# Altium project loz-old-man.PrjPcb (part 4 of 5)

## Sheet Microprocessor1.SchDoc
size B; Organization: The Pennsylvania State University - Applied Research Laboratory; DocumentNumber: 9; SheetNumber: 9; SheetTotal: 14; PageSetup: Record=PageOptions|CenterHorizontal=True|CenterVertical=True|PrintScale=0.99|XCorrection=1.00|YCorrection=1.00|PrintKind=1|BorderSize=5000000|LeftOffset=0|BottomOffset=0|Orientation=2|PaperLength=1000|PaperWidth=1000|Scale=100|PaperSource=7|PrintQuality=-4|MediaType=1|DitherType=10|PaperKind=Tabloid (11 x 17")|PrintScaleMode=1; SCHEMATIC_SHEET_TITLE: LPC4357 P0-PA; PAGE_TITLE: -
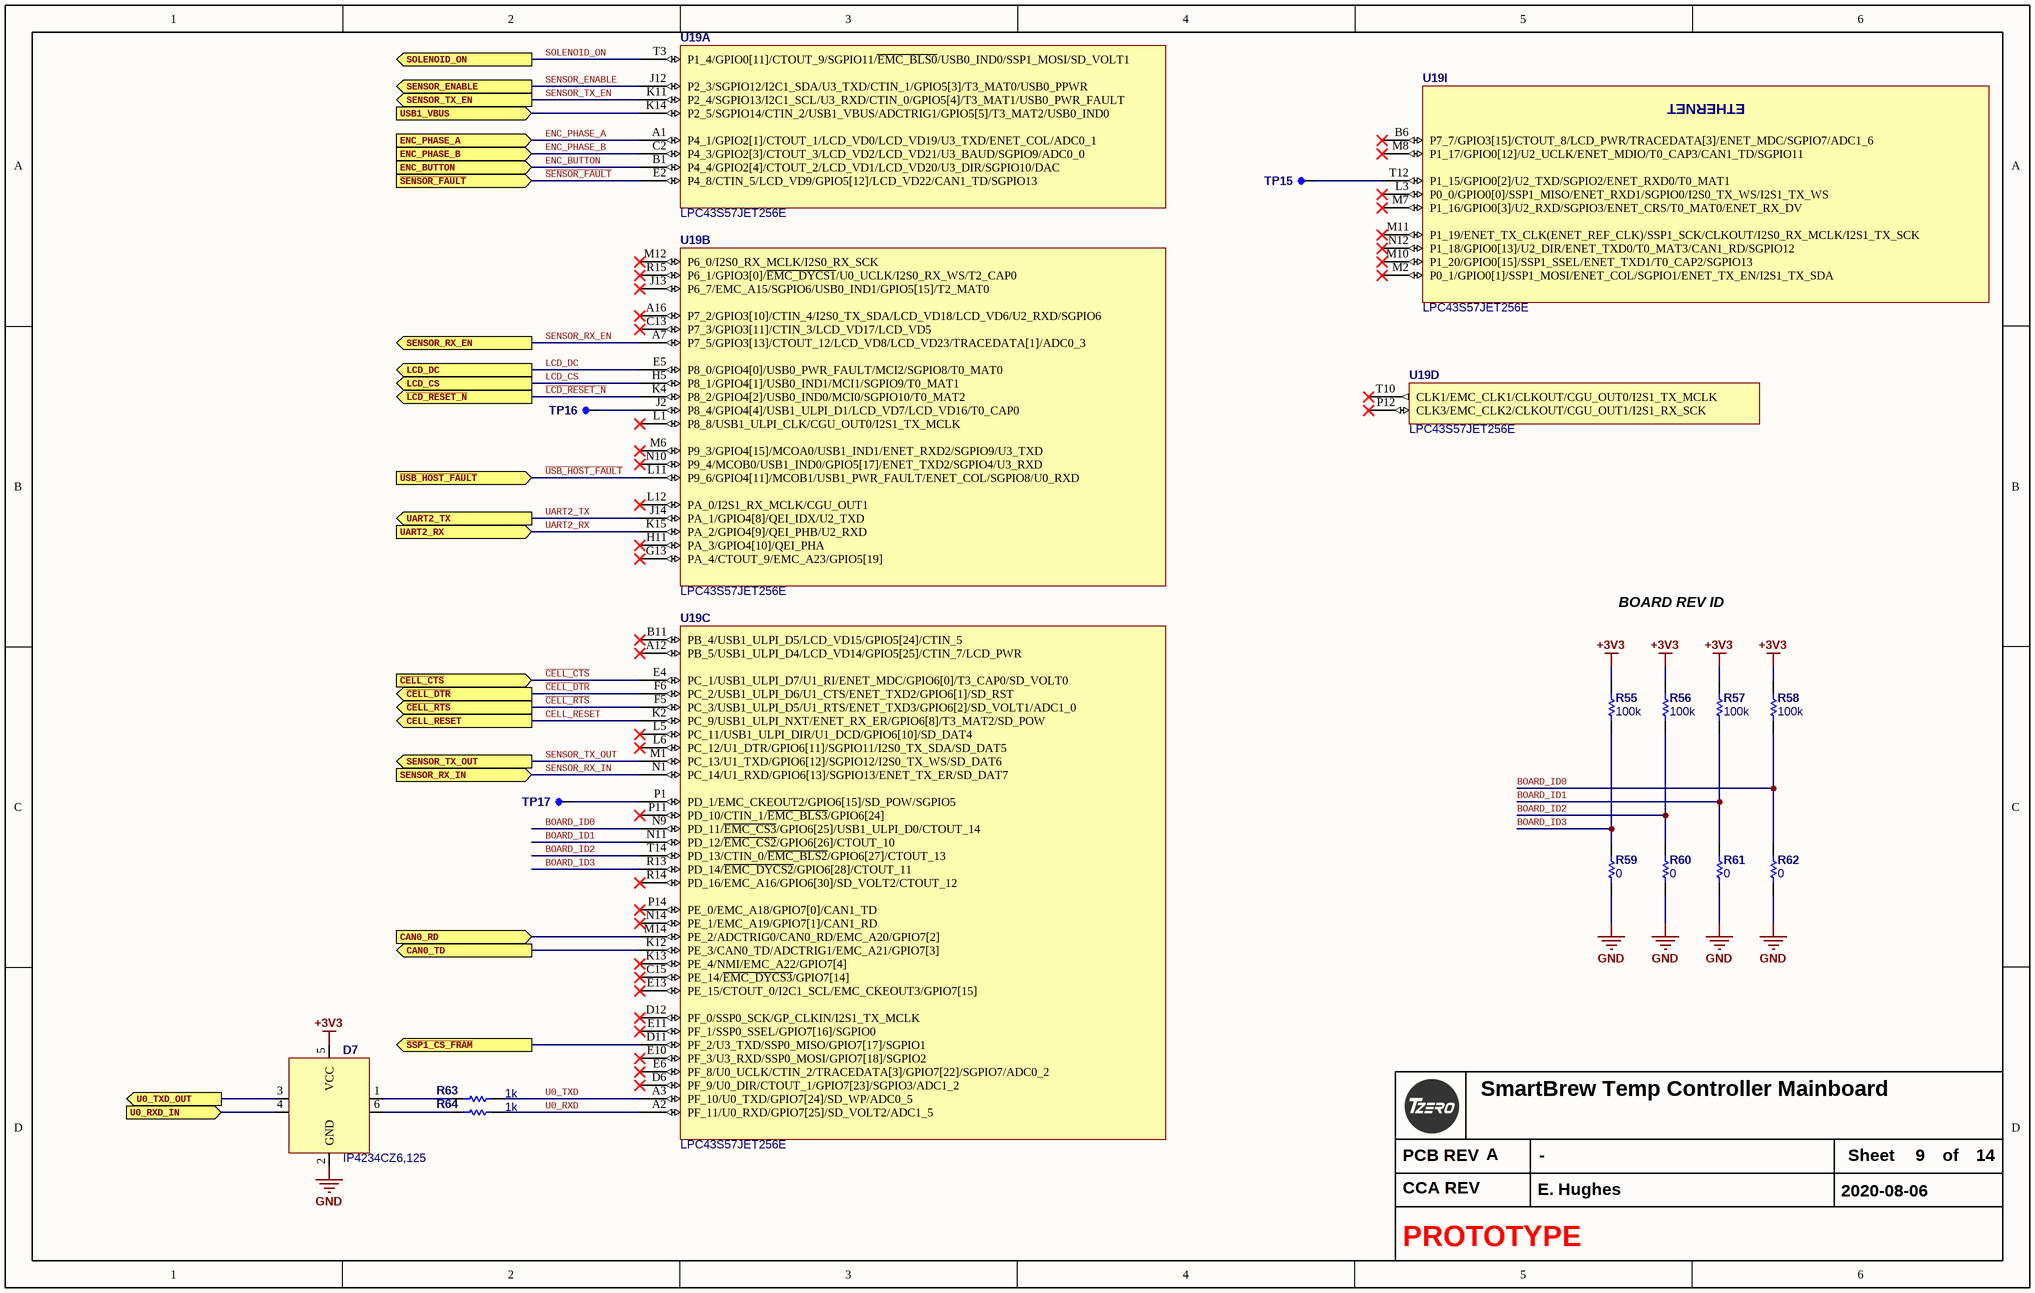
[diagram p9: Microprocessor1.SchDoc]

### Parts
D7  IP4234CZ6,125  [SOT427_MEDIUM]
R55  100k  [R0603_0.55MM_MD]
R56  100k  [R0603_0.55MM_MD]
R57  100k  [R0603_0.55MM_MD]
R58  100k  [R0603_0.55MM_MD]
R59  0  [R0603_0.55MM_MD]
R60  0  [R0603_0.55MM_MD]
R61  0  [R0603_0.55MM_MD]
R62  0  [R0603_0.55MM_MD]
R63  1k  [R0603_0.55MM_MD]
R64  1k  [R0603_0.55MM_MD]
TP15  (no value)  [TP_SMT_25_MIL_ROUND]  (net tie, no BOM)
TP16  (no value)  [TP_SMT_25_MIL_ROUND]  (net tie, no BOM)
TP17  (no value)  [TP_SMT_25_MIL_ROUND]  (net tie, no BOM)
U19  LPC43S57JET256E  [LBGA256 16X16 1700X1700X155]  (parts A,B,C,D,I of 10)

### Ports
CAN0_RD (in), CAN0_TD (out), CELL_RESET (out), ENC_BUTTON (in), ENC_PHASE_A (in), ENC_PHASE_B (in), LCD_CS (out), LCD_DC (out), SENSOR_ENABLE (out), SENSOR_RX_EN (out), SENSOR_RX_IN (in), SENSOR_TX_EN (out), SENSOR_TX_OUT (out), SOLENOID_ON (out), U0_RXD_IN (in), U0_TXD_OUT (out), UART2_RX (in), UART2_TX (out), USB1_VBUS (in), ~{CELL_CTS} (in), ~{CELL_DTR} (out), ~{CELL_RTS} (out), ~{LCD_RESET_N} (out), ~{SENSOR_FAULT} (in), ~{SSP1_CS_FRAM} (out), ~{USB_HOST_FAULT} (in)

### Nets
+3V3: D7.5(VCC) R55.1 R56.1 R57.1 R58.1
GND: D7.2(GND) R59.2 R60.2 R61.2 R62.2
~{CELL_CTS}: U19.E4(PC_1/USB1_ULPI_D7/U1_RI/ENET_MDC/GPIO6[0]/T3_CAP0/SD_VOLT0) ; port ~{CELL_CTS}
~{CELL_DTR}: U19.F6(PC_2/USB1_ULPI_D6/U1_CTS/ENET_TXD2/GPIO6[1]/SD_RST) ; port ~{CELL_DTR}
~{CELL_RTS}: U19.F5(PC_3/USB1_ULPI_D5/U1_RTS/ENET_TXD3/GPIO6[2]/SD_VOLT1/ADC1_0) ; port ~{CELL_RTS}
~{LCD_RESET_N}: U19.K4(P8_2/GPIO4[2]/USB0_IND0/MCI0/SGPIO10/T0_MAT2) ; port ~{LCD_RESET_N}
~{SENSOR_FAULT}: U19.E2(P4_8/CTIN_5/LCD_VD9/GPIO5[12]/LCD_VD22/CAN1_TD/SGPIO13) ; port ~{SENSOR_FAULT}
~{SSP1_CS_FRAM}: U19.D11(PF_2/U3_TXD/SSP0_MISO/GPIO7[17]/SGPIO1) ; port ~{SSP1_CS_FRAM}
~{USB_HOST_FAULT}: U19.L11(P9_6/GPIO4[11]/MCOB1/USB1_PWR_FAULT/ENET_COL/SGPIO8/U0_RXD) ; port ~{USB_HOST_FAULT}
BOARD_ID0: R58.2 R62.1 U19.N9(PD_11/~{EMC_CS3}/GPIO6[25]/USB1_ULPI_D0/CTOUT_14)
BOARD_ID1: R57.2 R61.1 U19.N11(PD_12/~{EMC_CS2}/GPIO6[26]/CTOUT_10)
BOARD_ID2: R56.2 R60.1 U19.T14(PD_13/CTIN_0/~{EMC_BLS2}/GPIO6[27]/CTOUT_13)
BOARD_ID3: R55.2 R59.1 U19.R13(PD_14/~{EMC_DYCS2}/GPIO6[28]/CTOUT_11)
CAN0_RD: U19.M14(PE_2/ADCTRIG0/CAN0_RD/EMC_A20/GPIO7[2]) ; port CAN0_RD
CAN0_TD: U19.K12(PE_3/CAN0_TD/ADCTRIG1/EMC_A21/GPIO7[3]) ; port CAN0_TD
CELL_RESET: U19.K2(PC_9/USB1_ULPI_NXT/ENET_RX_ER/GPIO6[8]/T3_MAT2/SD_POW) ; port CELL_RESET
ENC_BUTTON: U19.B1(P4_4/GPIO2[4]/CTOUT_2/LCD_VD1/LCD_VD20/U3_DIR/SGPIO10/DAC) ; port ENC_BUTTON
ENC_PHASE_A: U19.A1(P4_1/GPIO2[1]/CTOUT_1/LCD_VD0/LCD_VD19/U3_TXD/ENET_COL/ADC0_1) ; port ENC_PHASE_A
ENC_PHASE_B: U19.C2(P4_3/GPIO2[3]/CTOUT_3/LCD_VD2/LCD_VD21/U3_BAUD/SGPIO9/ADC0_0) ; port ENC_PHASE_B
LCD_CS: U19.H5(P8_1/GPIO4[1]/USB0_IND1/MCI1/SGPIO9/T0_MAT1) ; port LCD_CS
LCD_DC: U19.E5(P8_0/GPIO4[0]/USB0_PWR_FAULT/MCI2/SGPIO8/T0_MAT0) ; port LCD_DC
SENSOR_ENABLE: U19.J12(P2_3/SGPIO12/I2C1_SDA/U3_TXD/CTIN_1/GPIO5[3]/T3_MAT0/USB0_PPWR) ; port SENSOR_ENABLE
SENSOR_RX_EN: U19.A7(P7_5/GPIO3[13]/CTOUT_12/LCD_VD8/LCD_VD23/TRACEDATA[1]/ADC0_3) ; port SENSOR_RX_EN
SENSOR_RX_IN: U19.N1(PC_14/U1_RXD/GPIO6[13]/SGPIO13/ENET_TX_ER/SD_DAT7) ; port SENSOR_RX_IN
SENSOR_TX_EN: U19.K11(P2_4/SGPIO13/I2C1_SCL/U3_RXD/CTIN_0/GPIO5[4]/T3_MAT1/USB0_PWR_FAULT) ; port SENSOR_TX_EN
SENSOR_TX_OUT: U19.M1(PC_13/U1_TXD/GPIO6[12]/SGPIO12/I2S0_TX_WS/SD_DAT6) ; port SENSOR_TX_OUT
SOLENOID_ON: U19.T3(P1_4/GPIO0[11]/CTOUT_9/SGPIO11/~{EMC_BLS0}/USB0_IND0/SSP1_MOSI/SD_VOLT1) ; port SOLENOID_ON
U0_RXD: R64.2 U19.A2(PF_11/U0_RXD/GPIO7[25]/SD_VOLT2/ADC1_5)
U0_RXD_IN: D7.4 ; port U0_RXD_IN
U0_TXD: R63.2 U19.A3(PF_10/U0_TXD/GPIO7[24]/SD_WP/ADC0_5)
U0_TXD_OUT: D7.3 ; port U0_TXD_OUT
UART2_RX: U19.K15(PA_2/GPIO4[9]/QEI_PHB/U2_RXD) ; port UART2_RX
UART2_TX: U19.J14(PA_1/GPIO4[8]/QEI_IDX/U2_TXD) ; port UART2_TX
USB1_VBUS: U19.K14(P2_5/SGPIO14/CTIN_2/USB1_VBUS/ADCTRIG1/GPIO5[5]/T3_MAT2/USB0_IND0) ; port USB1_VBUS
NetD7_1: D7.1 R63.1
NetD7_6: D7.6 R64.1
NetTP15_1: TP15.1 U19.T12(P1_15/GPIO0[2]/U2_TXD/SGPIO2/ENET_RXD0/T0_MAT1)
NetTP16_1: TP16.1 U19.J2(P8_4/GPIO4[4]/USB1_ULPI_D1/LCD_VD7/LCD_VD16/T0_CAP0)
NetTP17_1: TP17.1 U19.P1(PD_1/EMC_CKEOUT2/GPIO6[15]/SD_POW/SGPIO5)

Not connected (* = marked no-connect by the designer): U19 A12(PB_5/USB1_ULPI_D4/LCD_VD14/GPIO5[25]/CTIN_7/LCD_PWR)* A16(P7_2/GPIO3[10]/CTIN_4/I2S0_TX_SDA/LCD_VD18/LCD_VD6/U2_RXD/SGPIO6)* B6(P7_7/GPIO3[15]/CTOUT_8/LCD_PWR/TRACEDATA[3]/ENET_MDC/SGPIO7/ADC1_6)* B11(PB_4/USB1_ULPI_D5/LCD_VD15/GPIO5[24]/CTIN_5)* C13(P7_3/GPIO3[11]/CTIN_3/LCD_VD17/LCD_VD5)* C15(PE_14/~{EMC_DYCS3}/GPIO7[14])* D6(PF_9/U0_DIR/CTOUT_1/GPIO7[23]/SGPIO3/ADC1_2)* D12(PF_0/SSP0_SCK/GP_CLKIN/I2S1_TX_MCLK)* E6(PF_8/U0_UCLK/CTIN_2/TRACEDATA[3]/GPIO7[22]/SGPIO7/ADC0_2)* E10(PF_3/U3_RXD/SSP0_MOSI/GPIO7[18]/SGPIO2)* E11(PF_1/SSP0_SSEL/GPIO7[16]/SGPIO0)* E13(PE_15/CTOUT_0/I2C1_SCL/EMC_CKEOUT3/GPIO7[15])* G13(PA_4/CTOUT_9/EMC_A23/GPIO5[19])* H11(PA_3/GPIO4[10]/QEI_PHA)* J13(P6_7/EMC_A15/SGPIO6/USB0_IND1/GPIO5[15]/T2_MAT0)* K13(PE_4/NMI/EMC_A22/GPIO7[4])* L1(P8_8/USB1_ULPI_CLK/CGU_OUT0/I2S1_TX_MCLK)* L3(P0_0/GPIO0[0]/SSP1_MISO/ENET_RXD1/SGPIO0/I2S0_TX_WS/I2S1_TX_WS)* L5(PC_11/USB1_ULPI_DIR/U1_DCD/GPIO6[10]/SD_DAT4)* L6(PC_12/U1_DTR/GPIO6[11]/SGPIO11/I2S0_TX_SDA/SD_DAT5)* L12(PA_0/I2S1_RX_MCLK/CGU_OUT1)* M2(P0_1/GPIO0[1]/SSP1_MOSI/ENET_COL/SGPIO1/ENET_TX_EN/I2S1_TX_SDA)* M6(P9_3/GPIO4[15]/MCOA0/USB1_IND1/ENET_RXD2/SGPIO9/U3_TXD)* M7(P1_16/GPIO0[3]/U2_RXD/SGPIO3/ENET_CRS/T0_MAT0/ENET_RX_DV)* M8(P1_17/GPIO0[12]/U2_UCLK/ENET_MDIO/T0_CAP3/CAN1_TD/SGPIO11)* M10(P1_20/GPIO0[15]/SSP1_SSEL/ENET_TXD1/T0_CAP2/SGPIO13)* M11(P1_19/ENET_TX_CLK(ENET_REF_CLK)/SSP1_SCK/CLKOUT/I2S0_RX_MCLK/I2S1_TX_SCK)* M12(P6_0/I2S0_RX_MCLK/I2S0_RX_SCK)* N10(P9_4/MCOB0/USB1_IND0/GPIO5[17]/ENET_TXD2/SGPIO4/U3_RXD)* N12(P1_18/GPIO0[13]/U2_DIR/ENET_TXD0/T0_MAT3/CAN1_RD/SGPIO12)* N14(PE_1/EMC_A19/GPIO7[1]/CAN1_RD)* P11(PD_10/CTIN_1/~{EMC_BLS3}/GPIO6[24])* P12(CLK3/EMC_CLK2/CLKOUT/CGU_OUT1/I2S1_RX_SCK)* P14(PE_0/EMC_A18/GPIO7[0]/CAN1_TD)* R14(PD_16/EMC_A16/GPIO6[30]/SD_VOLT2/CTOUT_12)* R15(P6_1/GPIO3[0]/~{EMC_DYCS1}/U0_UCLK/I2S0_RX_WS/T2_CAP0)* T10(CLK1/EMC_CLK1/CLKOUT/CGU_OUT0/I2S1_TX_MCLK)*

### Notes on the sheet
- BOARD REV ID
- PCB REV
- Sheet
- of
- CCA REV
- (in symbol LPC43S57JET256E, part I) ETHERNET

### Library data of the parts
D7 = IP4234CZ6,125: IC USB2.0 ESD PROTECTION SOT457; Manufacturer: NXP Semiconductors; CategorySort: 400; Voltage - Reverse Standoff (Typ): 3V; Voltage - Breakdown: 6V; Power (Watts): 100W; Polarization: 2 Channel Array - Bidirectional; Value: IP4234CZ6,125; Sort Value: *; Category: Diodes; Supplier 1: Digi-Key; Supplier Part Number 1: 568-5869-1-ND; Manufacturer Part Number: IP4234CZ6,125; RoHS: RoHS Compliant; Stock 1: 5142; Pricing 1: 1=0.52, 10=0.418, 25=0.3656, 100=0.3135, 250=0.27076, 500=0.23276, 1000=0.1805 (USD); Mounting Type: Surface Mount; Package: SC-74, SOT-457; Supplier Device Package: 6-TSOP; Packaging: Cut Tape (CT); ComponentLink1URL: http://www.nxp.com/documents/data_sheet/IP4234CZ6.pdf; ComponentLink1Description: http://www.nxp.com/documents/data_sheet/IP4234CZ6.pdf; Manufacturer 1: NXP Semiconductors; Manufacturer Part Number 1: IP4234CZ6,125
R55-R58 = ERJ-3EKF1003V: RES 100K OHM 1/10W 1% 0603 SMD; Manufacturer: Panasonic Electronic Components; Package Power: 0603  (0.1W); Power (Watts): 0.1W- 1/10W; Temperature Coefficient: ±100ppm/°C; Limiting Element Voltage: 75; Maximum Overload Voltage: 150; Maximum Working Voltage: 75.0V; Substitution Notes: 100k , ±1% , 0603 , AEC-Q200; Value: 100k; Manufacturer Part Number: ERJ-3EKF1003V; ComponentLink1Description: Internal Datasheet; ComponentLink1URL: datasheets\Panasonic Electronic Components\AOA0000CE2.pdf; ComponentLink2Description: External Datasheet; ComponentLink2URL: http://industrial.panasonic.com/www-data/pdf/AOA0000/AOA0000CE2.pdf; Supplier 1: Digi-Key; Supplier Part Number 1: P100KHCT-ND; Category: Resistors; Resistance (Ohms): 100k; Composition: Thick Film; Features: -; Tolerance: ±1%; Package: 0603 (1608 Metric); Supplier Package: 0603; Size / Dimension: 0.063" L x 0.031" W (1.60mm x 0.80mm); Height: 0.55MM; Number of Terminations: 2; Packaging: Cut Tape (CT); Sort Value: 100000; Sort Value Package: 603_100000; Ratings: AEC-Q200
R59-R62 = ERJ-3GEY0R00V: RES 0.0 OHM 1/10W JUMP 0603 SMD; Manufacturer: Panasonic Electronic Components; Power (Watts): 0.1W- 1/10W; Tolerance: Jumper; Package Power: 0603  (0.1W); Limiting Element Voltage: 75; Maximum Overload Voltage: 150; Maximum Working Voltage: 0.0V; Substitution Notes: 0 , Jumper , 0603 , AEC-Q200; Value: 0; Supplier 1: Digi-Key; Supplier Part Number 1: P0.0GCT-ND; Manufacturer Part Number: ERJ-3GEY0R00V; Category: Resistors; Sort Value: 0; Composition: Thick Film; Features: -; Temperature Coefficient: -; Package: 0603 (1608 Metric); Size / Dimension: 0.063" L x 0.031" W (1.60mm x 0.80mm); Height: 0.55MM; ComponentLink1URL: datasheets\Panasonic Electronic Components\AOA0000CE1.pdf; ComponentLink1Description: Internal Datasheet; ComponentLink2Description: External Datasheet; ComponentLink2URL: http://industrial.panasonic.com/www-data/pdf/AOA0000/AOA0000CE1.pdf; Resistance (Ohms): 0; Supplier Package: 0603; Number of Terminations: 2; Sort Value Package: 603_0; Ratings: AEC-Q200
R63 R64 = ERJ-3EKF1001V: RES 1K OHM 1/10W 1% 0603 SMD; Manufacturer: Panasonic Electronic Components; Package Power: 0603  (0.1W); Power (Watts): 0.1W- 1/10W; Temperature Coefficient: ±100ppm/°C; Limiting Element Voltage: 75; Maximum Overload Voltage: 150; Maximum Working Voltage: 10.0V; Substitution Notes: 1k , ±1% , 0603 , AEC-Q200; Value: 1k; Manufacturer Part Number: ERJ-3EKF1001V; ComponentLink1Description: Internal Datasheet; ComponentLink1URL: datasheets\Panasonic Electronic Components\AOA0000CE2.pdf; ComponentLink2Description: External Datasheet; ComponentLink2URL: http://industrial.panasonic.com/www-data/pdf/AOA0000/AOA0000CE2.pdf; Supplier 1: Digi-Key; Supplier Part Number 1: P1.00KHCT-ND; Category: Resistors; Resistance (Ohms): 1k; Composition: Thick Film; Features: -; Tolerance: ±1%; Package: 0603 (1608 Metric); Supplier Package: 0603; Size / Dimension: 0.063" L x 0.031" W (1.60mm x 0.80mm); Height: 0.55MM; Number of Terminations: 2; Packaging: Cut Tape (CT); Sort Value: 1000; Sort Value Package: 603_1000; Ratings: AEC-Q200
TP15-TP17 = TP SMT 25MIL: Sort Value: *; Category: *; CategorySort: *
U19 = LPC43S57JET256E: ARM Microcontrollers - MCU CortexM0/4 32bit 1MB Cortex-M4/M0; Manufacturer: NXP Semiconductors; CategorySort: 600; Data RAM Size: 136 KB; Core: ARM Cortex M4/M0; Maximum Clock Frequency: 204 MHz; On-Chip ADC: Yes; Operating Supply Voltage: 2.2 V to 3.6 V; Processor Series: LPC4357; Product Status: New Technology; Value: LPC43S57JET256E; Sort Value: *; Category: Integrated Circuits; Supplier 1: Digi-Key; Supplier Part Number 1: 568-11712-ND; Manufacturer Part Number: LPC43S57JET256E; RoHS: RoHS Compliant; Stock 1: 108; Pricing 1: 1=14.40, 25=13.31, 100=12.24, 250=11.16, 500=10.43, 1000=9.57 (USD); Package: LBGA-256; Packaging: Tray; Mounting Style: SMD/SMT; Program Memory Size: 1 MB; Data Bus Width: 32 bit; Maximum Operating Temperature: + 85 C; Minimum Operating Temperature: - 40 C; Standard Pack Qty: 90; Tradename: LPC; RoHS - Mouser: Y; Minimum Order Quantity: 1; Reeling: False; ComponentLink1URL: http://www.nxp.com/documents/data_sheet/LPC4357_53_37_33.pdf; ComponentLink1Description: http://www.nxp.com/documents/data_sheet/LPC4357_53_37_33.pdf

## Sheet Microprocessor Power.SchDoc
size B; Organization: The Pennsylvania State University - Applied Research Laboratory; DocumentNumber: 8; SheetNumber: 8; SheetTotal: 14; PageSetup: Record=PageOptions|CenterHorizontal=True|CenterVertical=True|PrintScale=0.99|XCorrection=1.00|YCorrection=1.00|PrintKind=1|BorderSize=5000000|LeftOffset=0|BottomOffset=0|Orientation=2|PaperLength=1000|PaperWidth=1000|Scale=100|PaperSource=7|PrintQuality=-4|MediaType=1|DitherType=10|PaperKind=Tabloid (11 x 17")|PrintScaleMode=1; SCHEMATIC_SHEET_TITLE: MICROPROCESSOR POWER; PAGE_TITLE: -
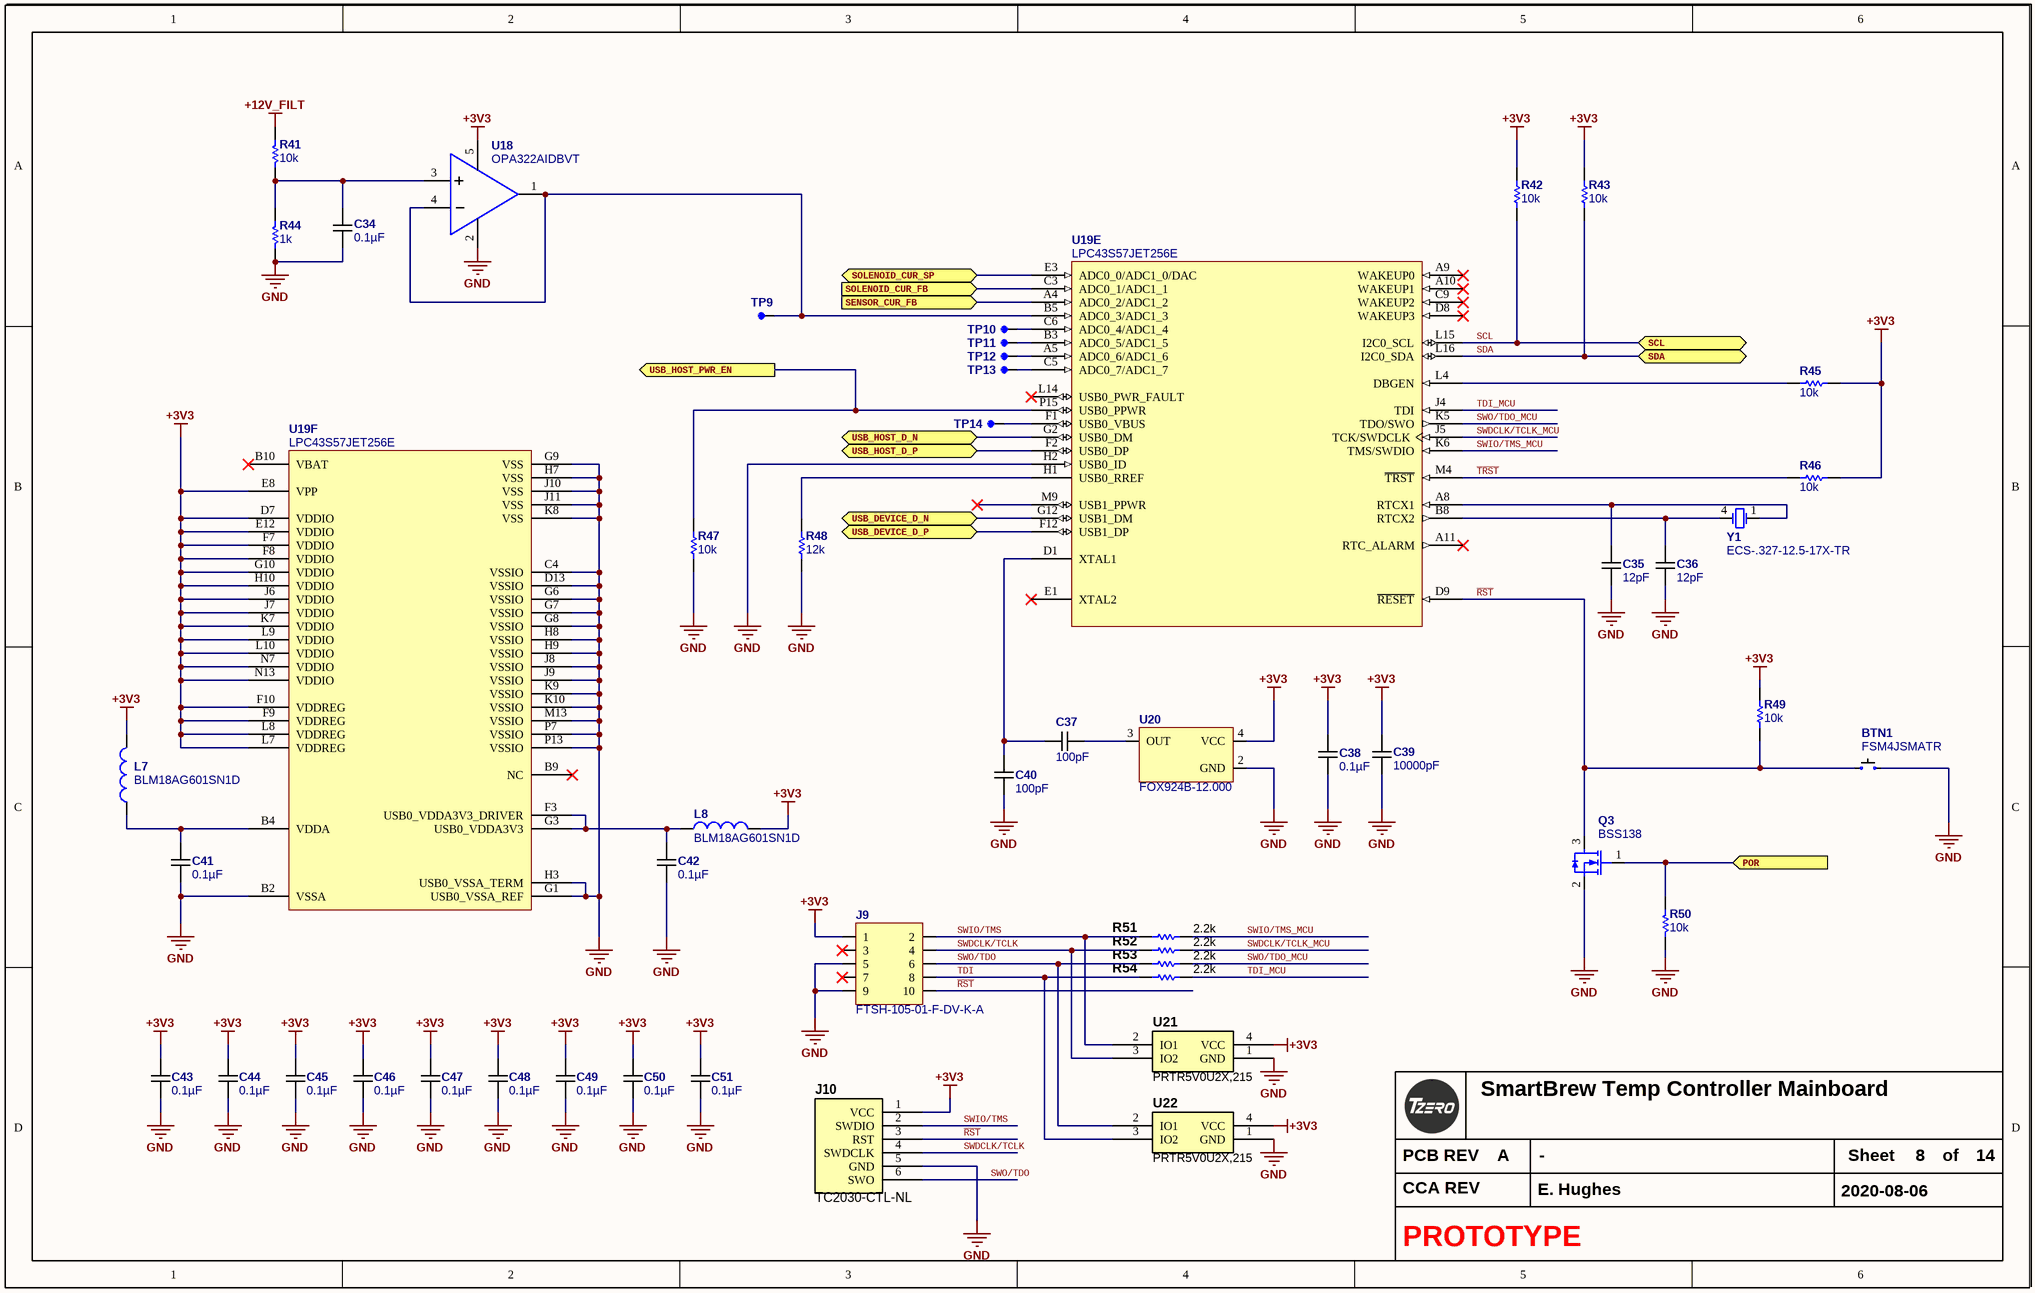
[diagram p10: Microprocessor Power.SchDoc]

### Parts
BTN1  FSM4JSMATR  [FSM4JSMA]
C34  0.1µF  [C0402_0.55MM_HD]
C35  12pF  [C0603_0.90MM_HD]
C36  12pF  [C0603_0.90MM_HD]
C37  100pF  [C0603_0.95MM_HD]
C38  0.1µF  [C0402_0.55MM_HD]
C39  10000pF  [C0603_0.90MM_HD]
C40  100pF  [C0603_0.95MM_HD]
C41  0.1µF  [C0402_0.55MM_HD]
C42  0.1µF  [C0402_0.55MM_HD]
C43  0.1µF  [C0402_0.55MM_HD]
C44  0.1µF  [C0402_0.55MM_HD]
C45  0.1µF  [C0402_0.55MM_HD]
C46  0.1µF  [C0402_0.55MM_HD]
C47  0.1µF  [C0402_0.55MM_HD]
C48  0.1µF  [C0402_0.55MM_HD]
C49  0.1µF  [C0402_0.55MM_HD]
C50  0.1µF  [C0402_0.55MM_HD]
C51  0.1µF  [C0402_0.55MM_HD]
J9  FTSH-105-01-F-DV-K-A  [FTSH-105-01-F-DV-K-A]
J10  TC2030‐CTL‐NL  [TC2030]  (no BOM)
L7  BLM18AG601SN1D  [L_0603_0.8mm]
L8  BLM18AG601SN1D  [L_0603_0.8mm]
Q3  BSS138  [SOT23_Medium]
R41  10k  [R0603_0.55MM_MD]
R42  10k  [R0603_0.55MM_HD]
R43  10k  [R0603_0.55MM_HD]
R44  1k  [R0603_0.55MM_MD]
R45  10k  [R0603_0.55MM_HD]
R46  10k  [R0603_0.55MM_HD]
R47  10k  [R0603_0.55MM_MD]
R48  12k  [R0603_0.55MM_HD]
R49  10k  [R0603_0.55MM_HD]
R50  10k  [R0603_0.55MM_HD]
R51  2.2k  [R0603_0.55MM_MD]
R52  2.2k  [R0603_0.55MM_MD]
R53  2.2k  [R0603_0.55MM_MD]
R54  2.2k  [R0603_0.55MM_MD]
TP9  (no value)  [TP_SMT_25_MIL_ROUND]  (net tie, no BOM)
TP10  (no value)  [TP_SMT_25_MIL_ROUND]  (net tie, no BOM)
TP11  (no value)  [TP_SMT_25_MIL_ROUND]  (net tie, no BOM)
TP12  (no value)  [TP_SMT_25_MIL_ROUND]  (net tie, no BOM)
TP13  (no value)  [TP_SMT_25_MIL_ROUND]  (net tie, no BOM)
TP14  (no value)  [TP_SMT_25_MIL_ROUND]  (net tie, no BOM)
U18  OPA322AIDBVT  [SOT23-5]
U19  LPC43S57JET256E  [LBGA256 16X16 1700X1700X155]  (parts E,F of 10)
U20  FOX924B-12.000  [FOX924]
U21  PRTR5V0U2X,215  [SOT143B]
U22  PRTR5V0U2X,215  [SOT143B]
Y1  ECS-.327-12.5-17X-TR  [ECX-306]

### Ports
POR (in), SCL (bidir), SDA (bidir), SENSOR_CUR_FB (in), SOLENOID_CUR_FB (in), SOLENOID_CUR_SP (bidir), USB_DEVICE_D_N (bidir), USB_DEVICE_D_P (bidir), USB_HOST_D_N (bidir), USB_HOST_D_P (bidir), USB_HOST_PWR_EN (out)

### Nets
+3V3: C38.2 C39.2 C43.2 C44.2 C45.2 C46.2 C47.2 C48.2 C49.2 C50.2 C51.2 J9.1 J10.1(VCC) L7.2 L8.2 R42.1 R43.1 R45.2 R46.2 R49.2 U18.5(VCC) U19.D7(VDDIO) U19.E8(VPP) U19.E12(VDDIO) U19.F7(VDDIO) U19.F8(VDDIO) U19.F9(VDDREG) U19.F10(VDDREG) U19.G10(VDDIO) U19.H10(VDDIO) U19.J6(VDDIO) U19.J7(VDDIO) U19.K7(VDDIO) U19.L7(VDDREG) U19.L8(VDDREG) U19.L9(VDDIO) U19.L10(VDDIO) U19.N7(VDDIO) U19.N13(VDDIO) U20.4(VCC) U21.4(VCC) U22.4(VCC)
+12V_FILT: R41.2
GND: BTN1.B C34.1 C35.1 C36.1 C38.1 C39.1 C40.2 C41.1 C42.1 C43.1 C44.1 C45.1 C46.1 C47.1 C48.1 C49.1 C50.1 C51.1 J9.5 J9.9 J10.5(GND) Q3.2(S) R44.2 R47.2 R48.2 R50.1 U18.2(GND) U19.B2(VSSA) U19.C4(VSSIO) U19.D13(VSSIO) U19.G1(USB0_VSSA_REF) U19.G6(VSSIO) U19.G7(VSSIO) U19.G8(VSSIO) U19.G9(VSS) U19.H2(USB0_ID) U19.H3(USB0_VSSA_TERM) U19.H7(VSS) U19.H8(VSSIO) U19.H9(VSSIO) U19.J8(VSSIO) U19.J9(VSSIO) U19.J10(VSS) U19.J11(VSS) U19.K8(VSS) U19.K9(VSSIO) U19.K10(VSSIO) U19.M13(VSSIO) U19.P7(VSSIO) U19.P13(VSSIO) U20.2(GND) U21.1(GND) U22.1(GND)
~{RST}: BTN1.A J9.10 J10.3(RST) Q3.3(D) R49.1 U19.D9(~{RESET})
~{TRST}: R46.1 U19.M4(~{TRST})
POR: Q3.1(G) R50.2 ; port POR
SCL: R42.2 U19.L15(I2C0_SCL) ; port SCL
SDA: R43.2 U19.L16(I2C0_SDA) ; port SDA
SENSOR_CUR_FB: U19.A4(ADC0_2/ADC1_2) ; port SENSOR_CUR_FB
SOLENOID_CUR_FB: U19.C3(ADC0_1/ADC1_1) ; port SOLENOID_CUR_FB
SOLENOID_CUR_SP: U19.E3(ADC0_0/ADC1_0/DAC) ; port SOLENOID_CUR_SP
SWDCLK/TCLK: J9.4 J10.4(SWDCLK) R52.1 U21.3(IO2)
SWDCLK/TCLK_MCU: R52.2 U19.J5(TCK/SWDCLK)
SWIO/TMS: J9.2 J10.2(SWDIO) R51.1 U21.2(IO1)
SWIO/TMS_MCU: R51.2 U19.K6(TMS/SWDIO)
SWO/TDO: J9.6 J10.6(SWO) R53.1 U22.2(IO1)
SWO/TDO_MCU: R53.2 U19.K5(TDO/SWO)
TDI: J9.8 R54.1 U22.3(IO2)
TDI_MCU: R54.2 U19.J4(TDI)
USB_DEVICE_D_N: U19.G12(USB1_DM) ; port USB_DEVICE_D_N
USB_DEVICE_D_P: U19.F12(USB1_DP) ; port USB_DEVICE_D_P
USB_HOST_D_N: U19.G2(USB0_DM) ; port USB_HOST_D_N
USB_HOST_D_P: U19.F2(USB0_DP) ; port USB_HOST_D_P
USB_HOST_PWR_EN: R47.1 U19.P15(USB0_PPWR) ; port USB_HOST_PWR_EN
NetC34_2: C34.2 R41.1 R44.1 U18.3(+)
NetC35_2: C35.2 U19.A8(RTCX1) Y1.1(OSC1)
NetC36_2: C36.2 U19.B8(RTCX2) Y1.4(OSC2)
NetC37_1: C37.1 U20.3(OUT)
NetC37_2: C37.2 C40.1 U19.D1(XTAL1)
NetC41_2: C41.2 L7.1 U19.B4(VDDA)
NetC42_2: C42.2 L8.1 U19.F3(USB0_VDDA3V3_DRIVER) U19.G3(USB0_VDDA3V3)
NetR45_1: R45.1 U19.L4(DBGEN)
NetR48_1: R48.1 U19.H1(USB0_RREF)
NetTP9_1: TP9.1 U18.1(OUT) U18.4(-) U19.B5(ADC0_3/ADC1_3)
NetTP10_1: TP10.1 U19.C6(ADC0_4/ADC1_4)
NetTP11_1: TP11.1 U19.B3(ADC0_5/ADC1_5)
NetTP12_1: TP12.1 U19.A5(ADC0_6/ADC1_6)
NetTP13_1: TP13.1 U19.C5(ADC0_7/ADC1_7)
NetTP14_1: TP14.1 U19.F1(USB0_VBUS)

Not connected (* = marked no-connect by the designer): J9 3* 7*; U19 A9(WAKEUP0)* A10(WAKEUP1)* A11(RTC_ALARM)* B9(NC)* B10(VBAT)* C9(WAKEUP2)* D8(WAKEUP3)* E1(XTAL2)* L14(USB0_PWR_FAULT)* M9(USB1_PPWR)*

### Notes on the sheet
- PCB REV
- Sheet
- of
- CCA REV

### Library data of the parts
BTN1 = FSM4JSMATR: SWITCH TACTILE SPST-NO 0.05A 12V; Manufacturer: TE Connectivity; Switch Function: Off-Mom; Contact Rating @ Voltage: 0.05A @ 12VDC; Actuator Type: Standard; Actuator Orientation: Top Actuated; Outline: 6.00mm x 6.00mm; Illumination: Non-Illuminated; Operating Force: 160gf; Supplier 1: Digi-Key; Supplier Part Number 1: 450-1759-1-ND; Manufacturer Part Number: FSM4JSMATR; RoHS: RoHS Compliant; Category: Switches; Stock 1: 35617; Pricing 1: 1=0.36, 10=0.34, 25=0.2912, 50=0.2474, 100=0.2377, 250=0.21344, 500=0.20374 (USD); Circuit: SPST-NO; Mounting Type: Surface Mount; Termination Style: Gull Wing; Packaging: Cut Tape (CT); ComponentLink1URL: http://documents.tycoelectronics.com/commerce/DocumentDelivery/DDEController?Action=srchrtrv&DocNm=2-1437565-7&DocType=CD&DocLang=EN; ComponentLink1Description: http://documents.tycoelectronics.com/commerce/DocumentDelivery/DDEController?Action=srchrtrv&DocNm=2-1437565-7&DocType=CD&DocLang=EN; Value: FSM4JSMATR
C34 C38 C41-C51 = CGA2B3X7R1E104K050BB: CAP CER 0.1UF 25V X7R 0402; Manufacturer: TDK Corporation; Tolerance: ±10%; Substitution Notes: 0.1µF , 25V , ±10% , X7R , -55°C ~ 125°C , AEC-Q200 , 0402; Value: 0.1µF; Temperature Coefficient: X7R; Manufacturer Part Number: CGA2B3X7R1E104K050BB; ComponentLink1Description: Datasheet (Internal); ComponentLink1URL: datasheets\TDK\mlcc_automotive_general_en.pdf; ComponentLink2Description: Datasheet (External); ComponentLink2URL: https://product.tdk.com/info/en/catalog/datasheets/mlcc_automotive_general_en.pdf; Supplier 1: Digikey; Supplier Part Number 1: 445-6902-1-ND; Category: Capacitors; Voltage - Rated: 25V; Features: -; Operating Temperature: -55°C ~ 125°C; Ratings: AEC-Q200; Package: 0402; Thickness (Max): 0.55MM
C35 C36 = CGA3E2C0G1H120J080AA: CAP CER 12PF 50V C0G 0603; Manufacturer: TDK Corporation; Temperature Coefficient: C0G, NP0; Tolerance: ±5%; Substitution Notes: 12pF , 50V , ±5% , C0G, NP0 , -55°C ~ 125°C , AEC-Q200 , 0603; Value: 12pF; Manufacturer Part Number: CGA3E2C0G1H120J080AA; ComponentLink1Description: Datasheet (Internal); ComponentLink1URL: datasheets\TDK\mlcc_automotive_general_en.pdf; ComponentLink2Description: Datasheet (External); ComponentLink2URL: https://product.tdk.com/info/en/catalog/datasheets/mlcc_automotive_general_en.pdf; Supplier 1: Digikey; Supplier Part Number 1: 445-5629-1-ND; Category: Capacitors; Voltage - Rated: 50V; Operating Temperature: -55°C ~ 125°C; Ratings: AEC-Q200; Package: 0603; Thickness (Max): 0.90MM; Features: -
C37 C40 = CGA3E2C0G1H101J080AE: CAP CER 100PF 50V NP0 0603; Manufacturer: TDK Corporation; Temperature Coefficient: C0G, NP0; Tolerance: ±5%; Substitution Notes: 100pF , 50V , ±5% , C0G, NP0 , -55°C ~ 125°C , AEC-Q200 , 0603; Value: 100pF; Manufacturer Part Number: CGA3E2C0G1H101J080AE; ComponentLink1Description: Datasheet (Internal); ComponentLink1URL: datasheets\TDK\mlcc_automotive_general_en.pdf; ComponentLink2Description: Datasheet (External); ComponentLink2URL: https://product.tdk.com/info/en/catalog/datasheets/mlcc_automotive_general_en.pdf; Supplier 1: Digikey; Supplier Part Number 1: 445-173653-1-ND; Category: Capacitors; Voltage - Rated: 50V; Operating Temperature: -55°C ~ 125°C; Ratings: AEC-Q200; Package: 0603; Thickness (Max): 0.95MM; Features: Soft Termination
C39 = CGA3E2C0G1H103J080AA: CAP CER 10000PF 50V C0G 0603; Manufacturer: TDK Corporation; Temperature Coefficient: C0G, NP0; Tolerance: ±5%; Substitution Notes: 10000pF , 50V , ±5% , C0G, NP0 , -55°C ~ 125°C , AEC-Q200 , 0603; Value: 10000pF; Manufacturer Part Number: CGA3E2C0G1H103J080AA; ComponentLink1Description: Datasheet (Internal); ComponentLink1URL: datasheets\TDK\mlcc_automotive_general_en.pdf; ComponentLink2Description: Datasheet (External); ComponentLink2URL: https://product.tdk.com/info/en/catalog/datasheets/mlcc_automotive_general_en.pdf; Supplier 1: Digikey; Supplier Part Number 1: 445-6916-1-ND; Category: Capacitors; Voltage - Rated: 50V; Features: -; Operating Temperature: -55°C ~ 125°C; Ratings: AEC-Q200; Package: 0603; Thickness (Max): 0.90MM
J9 = FTSH-105-01-F-DV-K-A: CONN HEADER 10POS DUAL .05" SMD; Manufacturer: Samtec Inc; CategorySort: 800; Connector Type: Header, Unshrouded; Number of Positions: 10; Number of Positions Loaded: All; Pitch: 0.050" (1.27mm); Value: FTSH-105-01-F-DV-K-A; Sort Value: *; Category: Connectors; Supplier 1: Digi-Key; Supplier Part Number 1: FTSH-105-01-F-DV-K-A-ND; Manufacturer Part Number: FTSH-105-01-F-DV-K-A; RoHS: RoHS Compliant; Stock 1: 0; Pricing 1: 1=3.59 (USD); Packaging: Tube; Contact Type: Male Pin; Number of Rows: 2; Row Spacing: 0.050" (1.27mm); Contact Mating Length: 0.120" (3.05mm); Mounting Type: Surface Mount; Termination: Solder; Fastening Type: -; Features: -; Contact Finish: Gold; Contact Finish Thickness: 3µin (0.08µm); Color: Black; ComponentLink1URL: http://www.samtec.com/documents/webfiles/cpdf/FTSH-1XX-XX-XXX-DV-XXX-MKT.pdf; ComponentLink1Description: http://www.samtec.com/documents/webfiles/cpdf/FTSH-1XX-XX-XXX-DV-XXX-MKT.pdf
J10 = TC2030‐CTL‐NL: Tag Connect Pads - No latching Clips - ARM; Value: TC2030‐CTL‐NL
L7 L8 = BLM18AG601SN1D: FERRITE CHIP 600 OHM 500MA 0603; Manufacturer: Murata Electronics North America; CategorySort: 300; Impedance @ Frequency: 600 Ohm @ 100MHz; DC Resistance (DCR): 380 mOhm Max; Filter Type: Differential Mode - Single; Value: BLM18AG601SN1D; Sort Value: *; Category: Inductors; Supplier 1: Digi-Key; Supplier Part Number 1: 490-1014-1-ND; Manufacturer Part Number: BLM18AG601SN1D; RoHS: RoHS Compliant; Stock 1: 139441; Pricing 1: 1=0.1, 10=0.079, 50=0.0648, 100=0.0476, 250=0.0346, 500=0.0317, 1000=0.02738 (USD); Current Rating: 500mA; Package: 0603 (1608 Metric); Mounting Type: Surface Mount; Packaging: Cut Tape (CT); Height (Max): 0.037" (0.95mm); Size / Dimension: 0.063" L x 0.031" W (1.60mm x 0.80mm); ComponentLink1URL: http://search.murata.co.jp/Ceramy/image/img/PDF/ENG/L0110S0100BLM18A.pdf; ComponentLink1Description: http://search.murata.co.jp/Ceramy/image/img/PDF/ENG/L0110S0100BLM18A.pdf
Q3 = BSS138: FAIRCHILD SEMICONDUCTOR - BSS138 - N CHANNEL MOSFET, 50V, 220mA SOT-23; CategorySort: 500; Value: BSS138; Sort Value: *; Category: Semiconductors; Supplier 1: Newark; Manufacturer: FAIRCHILD SEMICONDUCTOR; Manufacturer Part Number: BSS138; RoHS: YES; Stock 1: 17000; Pricing 1: 1=0.077, 25=0.064, 100=0.049, 250=0.039, 500=0.035, 1000=0.03 (USD); ComponentLink1URL: http://www.fairchildsemi.com/ds/BS/BSS138.pdf; ComponentLink1Description: http://www.fairchildsemi.com/ds/BS/BSS138.pdf; Supplier Part Number 1: 58K8769; Package: SOT-23
R41 R50 = ERJ-3EKF1002V: RES 10K OHM 1/10W 1% 0603 SMD; Manufacturer: Panasonic Electronic Components; Package Power: 0603  (0.1W); Power (Watts): 0.1W- 1/10W; Temperature Coefficient: ±100ppm/°C; Limiting Element Voltage: 75; Maximum Overload Voltage: 150; Maximum Working Voltage: 31.6V; Substitution Notes: 10k , ±1% , 0603 , AEC-Q200; Value: 10k; Manufacturer Part Number: ERJ-3EKF1002V; ComponentLink1Description: Internal Datasheet; ComponentLink1URL: datasheets\Panasonic Electronic Components\AOA0000CE2.pdf; ComponentLink2Description: External Datasheet; ComponentLink2URL: http://industrial.panasonic.com/www-data/pdf/AOA0000/AOA0000CE2.pdf; Supplier 1: Digi-Key; Supplier Part Number 1: P10.0KHCT-ND; Category: Resistors; Resistance (Ohms): 10k; Composition: Thick Film; Features: -; Tolerance: ±1%; Package: 0603 (1608 Metric); Supplier Package: 0603; Size / Dimension: 0.063" L x 0.031" W (1.60mm x 0.80mm); Height: 0.55MM; Number of Terminations: 2; Packaging: Cut Tape (CT); Sort Value: 10000; Sort Value Package: 603_10000; Ratings: AEC-Q200
R42 R43 R45-R47 R49 = ERJ-3EKF1002V: RES 10K OHM 1/10W 1% 0603 SMD; Manufacturer: Panasonic Electronic Components; Power (Watts): 0.1W- 1/10W; Temperature Coefficient: ±100ppm/°C; Package Power: 0603  (0.1W); Limiting Element Voltage: 75; Maximum Overload Voltage: 150; Maximum Working Voltage: 31.6V; Substitution Notes: 10k , ±1% , 0603 , AEC-Q200; Value: 10k; Supplier 1: Digi-Key; Supplier Part Number 1: P10.0KHCT-ND; Manufacturer Part Number: ERJ-3EKF1002V; Category: Resistors; Sort Value: 10000; Composition: Thick Film; Features: -; Tolerance: ±1%; Package: 0603 (1608 Metric); Size / Dimension: 0.063" L x 0.031" W (1.60mm x 0.80mm); Height: 0.55MM; Packaging: Cut Tape (CT); ComponentLink1URL: datasheets\Panasonic Electronic Components\AOA0000CE2.pdf; ComponentLink1Description: Internal Datasheet; ComponentLink2Description: External Datasheet; ComponentLink2URL: http://industrial.panasonic.com/www-data/pdf/AOA0000/AOA0000CE2.pdf; Resistance (Ohms): 10k; Supplier Package: 0603; Number of Terminations: 2; Sort Value Package: 603_10000; Ratings: AEC-Q200
R44 = ERJ-3EKF1001V: as R63 on sheet Microprocessor1; Value: 1k; Manufacturer Part Number: ERJ-3EKF1001V; ComponentLink1Description: Internal Datasheet; ComponentLink1URL: datasheets\Panasonic Electronic Components\AOA0000CE2.pdf; ComponentLink2Description: External Datasheet; ComponentLink2URL: http://industrial.panasonic.com/www-data/pdf/AOA0000/AOA0000CE2.pdf; Supplier 1: Digi-Key; Supplier Part Number 1: P1.00KHCT-ND; Category: Resistors; Resistance (Ohms): 1k; Composition: Thick Film; Features: -; Tolerance: ±1%; Package: 0603 (1608 Metric); Supplier Package: 0603; Size / Dimension: 0.063" L x 0.031" W (1.60mm x 0.80mm); Height: 0.55MM; Number of Terminations: 2; Packaging: Cut Tape (CT); Sort Value: 1000; Sort Value Package: 603_1000; Ratings: AEC-Q200
R48 = ERJ-3EKF1202V: RES 12K OHM 1/10W 1% 0603 SMD; Manufacturer: Panasonic Electronic Components; Power (Watts): 0.1W- 1/10W; Temperature Coefficient: ±100ppm/°C; Package Power: 0603  (0.1W); Limiting Element Voltage: 75; Maximum Overload Voltage: 150; Maximum Working Voltage: 34.6V; Substitution Notes: 12k , ±1% , 0603 , AEC-Q200; Value: 12k; Supplier 1: Digi-Key; Supplier Part Number 1: P12.0KHCT-ND; Manufacturer Part Number: ERJ-3EKF1202V; Category: Resistors; Sort Value: 12000; Composition: Thick Film; Features: -; Tolerance: ±1%; Package: 0603 (1608 Metric); Size / Dimension: 0.063" L x 0.031" W (1.60mm x 0.80mm); Height: 0.55MM; Packaging: Cut Tape (CT); ComponentLink1URL: datasheets\Panasonic Electronic Components\AOA0000CE2.pdf; ComponentLink1Description: Internal Datasheet; ComponentLink2Description: External Datasheet; ComponentLink2URL: http://industrial.panasonic.com/www-data/pdf/AOA0000/AOA0000CE2.pdf; Resistance (Ohms): 12k; Supplier Package: 0603; Number of Terminations: 2; Sort Value Package: 603_12000; Ratings: AEC-Q200
R51-R54 = ERJ-3EKF2201V: RES 2.2K OHM 1/10W 1% 0603 SMD; Manufacturer: Panasonic Electronic Components; Package Power: 0603  (0.1W); Power (Watts): 0.1W- 1/10W; Temperature Coefficient: ±100ppm/°C; Limiting Element Voltage: 75; Maximum Overload Voltage: 150; Maximum Working Voltage: 14.8V; Substitution Notes: 2.2k , ±1% , 0603 , AEC-Q200; Value: 2.2k; Manufacturer Part Number: ERJ-3EKF2201V; ComponentLink1Description: Internal Datasheet; ComponentLink1URL: datasheets\Panasonic Electronic Components\AOA0000CE2.pdf; ComponentLink2Description: External Datasheet; ComponentLink2URL: http://industrial.panasonic.com/www-data/pdf/AOA0000/AOA0000CE2.pdf; Supplier 1: Digi-Key; Supplier Part Number 1: P2.20KHCT-ND; Category: Resistors; Resistance (Ohms): 2.2k; Composition: Thick Film; Features: -; Tolerance: ±1%; Package: 0603 (1608 Metric); Supplier Package: 0603; Size / Dimension: 0.063" L x 0.031" W (1.60mm x 0.80mm); Height: 0.55MM; Number of Terminations: 2; Packaging: Cut Tape (CT); Sort Value: 2200; Sort Value Package: 603_2200; Ratings: AEC-Q200
TP9-TP14 = TP SMT 25MIL: Sort Value: *; Category: *; CategorySort: *
U18 = OPA322AIDBVT: IC OPAMP GP 20MHZ RRO SOT23-5; Manufacturer: Texas Instruments; Number of Channels: 1; Min Supply Voltage: 1.8V; Max Supply Voltage: 5.5V; Slew Rate: 10V/µs; Input Bias Current: 10pA; Input Offset Voltage (Vos): 2mV; Voltage Gain: 130dB; Common Mode Rejection Ratio: 90dB; Operating Supply Current: 1.6mA; Nominal Supply Current: 1.5mA; Output Current per Channel: 65mA; Min Dual Supply Voltage: 900mV; Max Dual Supply Voltage: 2.75V; Power Supply Rejection Ratio (PSRR): 100dB; Max Frequency: 10MHz; Manufacturer Part Number: OPA322AIDBVT; Value: OPA322AIDBVT; Supplier 1: Digi-Key; Supplier Part Number 1: 296-29511-1-ND; RoHS: Yes; Category: Amplifiers - Op Amps, Buffer, Instrumentation; Stock: 3683; Pricing: 1=1.66000, 10=1.49500, 25=1.41000, 100=1.12800 (USD); Case/Package: SOT-23; Number of Pins: 5; Min Operating Temperature: -40°C; Max Operating Temperature: 125°C; Packaging: Tape and Reel; Package Quantity: 250; Number of Circuits: 1; Gain Bandwidth Product: 20MHz; Unity Gain Bandwidth Product: 20MHz; Number of Elements: 1; Max I/O Voltage: 2mV; Nominal Gain Bandwidth Product: 20MHz; Output Current: 65mA; Bandwidth: 20MHz; Number of Amplifiers: 1; Operating Supply Voltage: 2.75V; Length: 3.05mm; Height: 1.3mm; Width: 1.75mm; Radiation Hardening: No; Lead Free: Lead Free; REACH SVHC: No SVHC; ComponentLink1URL: https://datasheet.ciiva.com/1803/opa322-1803459.pdf?src-supplier=Digi-Key; ComponentLink1Description: https://datasheet.ciiva.com/1803/opa322-1803459.pdf?src-supplier=Digi-Key; ComponentLink2URL: https://datasheet.ciiva.com/7848/1481239-7848179.pdf?src-supplier=Element14; ComponentLink2Description: https://datasheet.ciiva.com/7848/1481239-7848179.pdf?src-supplier=Element14; ComponentLink3URL: https://datasheet.ciiva.com/1803/opa322-1803460.pdf?src-supplier=Digi-Key; ComponentLink3Description: https://datasheet.ciiva.com/1803/opa322-1803460.pdf?src-supplier=Digi-Key; ComponentLink4URL: https://datasheet.ciiva.com/1803/opa322-1803461.pdf?src-supplier=Digi-Key; ComponentLink4Description: https://datasheet.ciiva.com/1803/opa322-1803461.pdf?src-supplier=Digi-Key; ComponentLink5URL: https://datasheet.ciiva.com/14460/opa4322-14460092.pdf?src-supplier=Avnet; ComponentLink5Description: https://datasheet.ciiva.com/14460/opa4322-14460092.pdf?src-supplier=Avnet; ComponentLink6URL: https://datasheet.ciiva.com/48706/001071938-da-01-en-ic-opamp-gp-rr-opa322aidbvt-sot-23-5-tid-48706602.pdf?src-supplier=Conrad; ComponentLink6Description: https://datasheet.ciiva.com/48706/001071938-da-01-en-ic-opamp-gp-rr-opa322aidbvt-sot-23-5-tid-48706602.pdf?src-supplier=Conrad
U19 = LPC43S57JET256E: as U19 on sheet Microprocessor1; Value: LPC43S57JET256E; Sort Value: *; Category: Integrated Circuits; Supplier 1: Digi-Key; Supplier Part Number 1: 568-11712-ND; Manufacturer Part Number: LPC43S57JET256E; RoHS: RoHS Compliant; Stock 1: 108; Pricing 1: 1=14.40, 25=13.31, 100=12.24, 250=11.16, 500=10.43, 1000=9.57 (USD); Package: LBGA-256; Packaging: Tray; Mounting Style: SMD/SMT; Program Memory Size: 1 MB; Data Bus Width: 32 bit; Maximum Operating Temperature: + 85 C; Minimum Operating Temperature: - 40 C; Standard Pack Qty: 90; Tradename: LPC; RoHS - Mouser: Y; Minimum Order Quantity: 1; Reeling: False; ComponentLink1URL: http://www.nxp.com/documents/data_sheet/LPC4357_53_37_33.pdf; ComponentLink1Description: http://www.nxp.com/documents/data_sheet/LPC4357_53_37_33.pdf
U20 = FOX924B-12.000: OSC TCXO 12.00MHZ HCMOS SMD; Manufacturer: Fox Electronics; CategorySort: 600; Frequency: 12MHz; Voltage - Supply: 3.3V; Frequency Stability: ±2.5ppm; Current - Supply (Max): 6mA; Value: FOX924B-12.000; Sort Value: *; Category: Integrated Circuits; Supplier 1: Digi-Key; Supplier Part Number 1: 631-1068-1-ND; Manufacturer Part Number: FOX924B-12.000; RoHS: RoHS Compliant; Stock 1: 2663; Pricing 1: 1=3.76, 10=3.591, 50=3.403, 100=3.0438, 500=2.8728 (USD); Type: TCXO; Function: -; Output: HCMOS; Operating Temperature: -30°C ~ 85°C; Ratings: -; Mounting Type: Surface Mount; Size / Dimension: 0.197" L x 0.126" W (5.00mm x 3.20mm); Height: 0.059" (1.50mm); Package: 4-SMD, No Lead (DFN, LCC); Packaging: Cut Tape (CT); Current - Supply (Disable) (Max): -; ComponentLink1URL: http://www.foxonline.com/pdfs/fox924.pdf; ComponentLink1Description: http://www.foxonline.com/pdfs/fox924.pdf
U21 U22 = PRTR5V0U2X,215: TVS DIODE 5.5VWM SOT143B; Manufacturer: NXP Semiconductors; Bidirectional Channels: 2; Voltage - Reverse Standoff (Typ): 5.5V (Max); Voltage - Breakdown (Min): 6V; Power Line Protection: Yes; Capacitance @ Frequency: 1pF @ 1MHz; Supplier 1: Digi-Key; Supplier Part Number 1: 568-4140-1-ND; Manufacturer Part Number: PRTR5V0U2X,215; RoHS: RoHS Compliant; Category: Circuit Protection; Stock: 11734; Pricing: 1=0.57, 10=0.477, 25=0.418, 100=0.3578, 250=0.31036, 500=0.26286, 1000=0.20265 (USD); Packaging: Cut Tape (CT); Type: Steering (Rail to Rail); Unidirectional Channels: -; Voltage - Clamping (Max) @ Ipp: -; Current - Peak Pulse (10/1000µs): -; Power - Peak Pulse: -; Applications: General Purpose; Operating Temperature: -40°C ~ 85°C (TA); Mounting Type: Surface Mount; Package / Case: TO-253-4, TO-253AA; Supplier Device Package: SOT-143B; ComponentLink1URL: http://www.nxp.com/documents/data_sheet/PRTR5V0U2X.pdf; ComponentLink1Description: http://www.nxp.com/documents/data_sheet/PRTR5V0U2X.pdf; Value: PRTR5V0U2X,215
Y1 = ECS-.327-12.5-17X-TR: CRYSTAL 32.768KHZ 12.5PF SMD; Manufacturer: ECS Inc; CategorySort: 600; Frequency Tolerance: ±20ppm; ESR (Equivalent Series Resistance): 50 kOhm; Operating Mode: Fundamental; Value: ECS-.327-12.5-17X-TR; Sort Value: *; Category: Integrated Circuits; Supplier 1: Digi-Key; Supplier Part Number 1: XC1195CT-ND; Manufacturer Part Number: ECS-.327-12.5-17X-TR; RoHS: RoHS Compliant; Stock 1: 17619; Pricing 1: 1=1.31, 10=1.138, 50=0.9976, 100=0.7875, 500=0.665, 1000=0.525 (USD); Packaging: Cut Tape (CT); Type: kHz Crystal (Tuning Fork); Frequency: 32.768kHz; Frequency Stability: -; Load Capacitance: 12.5pF; Operating Temperature: -40°C ~ 85°C; Ratings: -; Mounting Type: Surface Mount; Package: 4-SOJ, 5.50mm pitch; Size / Dimension: 0.315" L x 0.150" W (8.00mm x 3.80mm); Height: 0.098" (2.50mm); ComponentLink1URL: http://www.ecsxtal.com/store/pdf/ecx-306x.pdf; ComponentLink1Description: http://www.ecsxtal.com/store/pdf/ecx-306x.pdf

## Sheet Flash Memory.SchDoc
size B; Organization: Pyrotechnics Management Inc.; DocumentNumber: 11; SheetNumber: 11; SheetTotal: 14; PageSetup: Record=PageOptions|CenterHorizontal=True|CenterVertical=True|PrintScale=0.99|XCorrection=1.00|YCorrection=1.00|PrintKind=1|BorderSize=5000000|LeftOffset=0|BottomOffset=0|Orientation=2|PaperLength=1000|PaperWidth=1000|Scale=100|PaperSource=7|PrintQuality=-4|MediaType=1|DitherType=10|PaperKind=Tabloid (11 x 17")|PrintScaleMode=1; SCHEMATIC_SHEET_TITLE: FLASH MEMORY; PAGE_TITLE: -
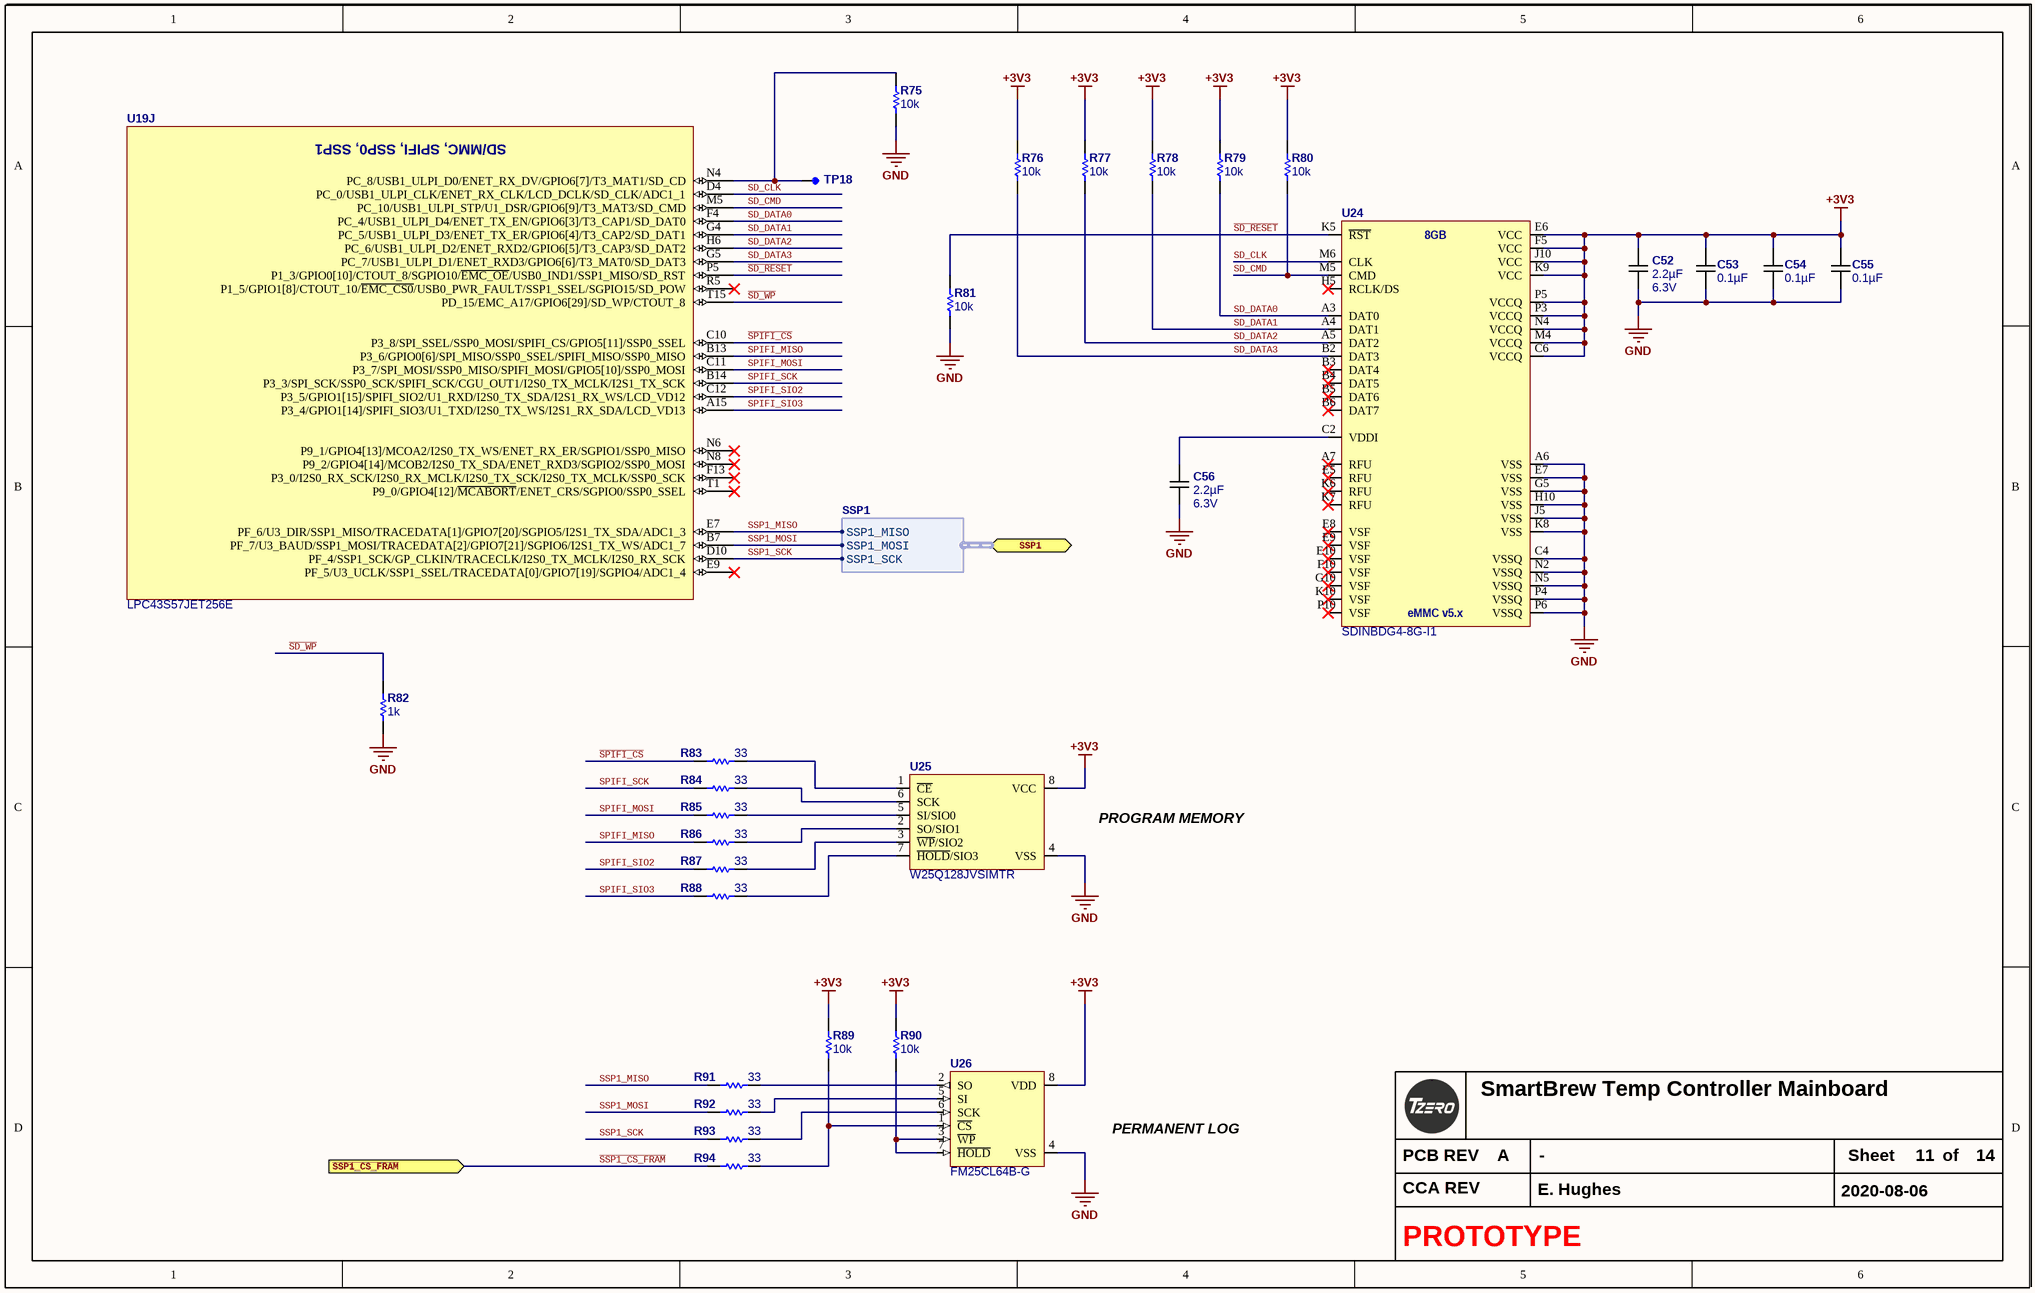
[diagram p11: Flash Memory.SchDoc]

### Parts
C52  2.2µF  Voltage - Rated: 6.3V  [C0603_0.90MM_HD]
C53  0.1µF  [C0402_0.55MM_HD]
C54  0.1µF  [C0402_0.55MM_HD]
C55  0.1µF  [C0402_0.55MM_HD]
C56  2.2µF  Voltage - Rated: 6.3V  [C0603_0.90MM_HD]
R75  10k  [R0603_0.55MM_MD]
R76  10k  [R0603_0.55MM_MD]
R77  10k  [R0603_0.55MM_MD]
R78  10k  [R0603_0.55MM_MD]
R79  10k  [R0603_0.55MM_MD]
R80  10k  [R0603_0.55MM_MD]
R81  10k  [R0603_0.55MM_MD]
R82  1k  [R0603_0.55MM_MD]
R83  33  [R0603_0.55MM_MD]
R84  33  [R0603_0.55MM_MD]
R85  33  [R0603_0.55MM_MD]
R86  33  [R0603_0.55MM_MD]
R87  33  [R0603_0.55MM_MD]
R88  33  [R0603_0.55MM_MD]
R89  10k  [R0603_0.55MM_MD]
R90  10k  [R0603_0.55MM_MD]
R91  33  [R0603_0.55MM_MD]
R92  33  [R0603_0.55MM_MD]
R93  33  [R0603_0.55MM_MD]
R94  33  [R0603_0.55MM_MD]
TP18  (no value)  [TP_SMT_25_MIL_ROUND]  (net tie, no BOM)
U19  LPC43S57JET256E  [LBGA256 16X16 1700X1700X155]  (part J of 10)
U24  SDINBDG4-8G-I1  [BGA_JDEC_EMMC_11.5x13.1x1.1_153PIN]
U25  W25Q128JVSIMTR  [SOIC-8W]
U26  FM25CL64B-G  [SOIC-8]

### Ports
SSP1 (bidir, harness SSP1), ~{SSP1_CS_FRAM} (in)

### Harnesses
SSP1: SSP1_MISO, SSP1_MOSI, SSP1_SCK

### Nets
+3V3: C52.2 C53.2 C54.2 C55.2 R76.2 R77.2 R78.2 R79.2 R80.2 R89.1 R90.2 U24.C6(VCCQ) U24.E6(VCC) U24.F5(VCC) U24.J10(VCC) U24.K9(VCC) U24.M4(VCCQ) U24.N4(VCCQ) U24.P3(VCCQ) U24.P5(VCCQ) U25.8(VCC) U26.8(VDD)
GND: C52.1 C53.1 C54.1 C55.1 C56.1 R75.1 R81.1 R82.1 U24.A6(VSS) U24.C4(VSSQ) U24.E7(VSS) U24.G5(VSS) U24.H10(VSS) U24.J5(VSS) U24.K8(VSS) U24.N2(VSSQ) U24.N5(VSSQ) U24.P4(VSSQ) U24.P6(VSSQ) U25.4(VSS) U26.4(VSS)
~{SD_RESET}: R81.2 U19.P5(P1_3/GPIO0[10]/CTOUT_8/SGPIO10/~{EMC_OE}/USB0_IND1/SSP1_MISO/SD_RST) U24.K5(~{RST})
~{SD_WP}: R82.2 U19.T15(PD_15/EMC_A17/GPIO6[29]/SD_WP/CTOUT_8)
~{SPIFI_CS}: R83.2 U19.C10(P3_8/SPI_SSEL/SSP0_MOSI/SPIFI_CS/GPIO5[11]/SSP0_SSEL)
~{SSP1_CS_FRAM}: R94.2 ; port ~{SSP1_CS_FRAM}
SD_CLK: U19.D4(PC_0/USB1_ULPI_CLK/ENET_RX_CLK/LCD_DCLK/SD_CLK/ADC1_1) U24.M6(CLK)
SD_CMD: R80.1 U19.M5(PC_10/USB1_ULPI_STP/U1_DSR/GPIO6[9]/T3_MAT3/SD_CMD) U24.M5(CMD)
SD_DATA0: R79.1 U19.F4(PC_4/USB1_ULPI_D4/ENET_TX_EN/GPIO6[3]/T3_CAP1/SD_DAT0) U24.A3(DAT0)
SD_DATA1: R78.1 U19.G4(PC_5/USB1_ULPI_D3/ENET_TX_ER/GPIO6[4]/T3_CAP2/SD_DAT1) U24.A4(DAT1)
SD_DATA2: R77.1 U19.H6(PC_6/USB1_ULPI_D2/ENET_RXD2/GPIO6[5]/T3_CAP3/SD_DAT2) U24.A5(DAT2)
SD_DATA3: R76.1 U19.G5(PC_7/USB1_ULPI_D1/ENET_RXD3/GPIO6[6]/T3_MAT0/SD_DAT3) U24.B2(DAT3)
SPIFI_MISO: R86.2 U19.B13(P3_6/GPIO0[6]/SPI_MISO/SSP0_SSEL/SPIFI_MISO/SSP0_MISO)
SPIFI_MOSI: R85.2 U19.C11(P3_7/SPI_MOSI/SSP0_MISO/SPIFI_MOSI/GPIO5[10]/SSP0_MOSI)
SPIFI_SCK: R84.2 U19.B14(P3_3/SPI_SCK/SSP0_SCK/SPIFI_SCK/CGU_OUT1/I2S0_TX_MCLK/I2S1_TX_SCK)
SPIFI_SIO2: R87.2 U19.C12(P3_5/GPIO1[15]/SPIFI_SIO2/U1_RXD/I2S0_TX_SDA/I2S1_RX_WS/LCD_VD12)
SPIFI_SIO3: R88.2 U19.A15(P3_4/GPIO1[14]/SPIFI_SIO3/U1_TXD/I2S0_TX_WS/I2S1_RX_SDA/LCD_VD13)
SSP1_MISO: R91.2 U19.E7(PF_6/U3_DIR/SSP1_MISO/TRACEDATA[1]/GPIO7[20]/SGPIO5/I2S1_TX_SDA/ADC1_3) ; port SSP1.SSP1_MISO
SSP1_MOSI: R92.2 U19.B7(PF_7/U3_BAUD/SSP1_MOSI/TRACEDATA[2]/GPIO7[21]/SGPIO6/I2S1_TX_WS/ADC1_7) ; port SSP1.SSP1_MOSI
SSP1_SCK: R93.2 U19.D10(PF_4/SSP1_SCK/GP_CLKIN/TRACECLK/I2S0_TX_MCLK/I2S0_RX_SCK) ; port SSP1.SSP1_SCK
NetC56_2: C56.2 U24.C2(VDDI)
NetR75_2: R75.2 TP18.1 U19.N4(PC_8/USB1_ULPI_D0/ENET_RX_DV/GPIO6[7]/T3_MAT1/SD_CD)
NetR83_1: R83.1 U25.1(~{CE})
NetR84_1: R84.1 U25.6(SCK)
NetR85_1: R85.1 U25.5(SI/SIO0)
NetR86_1: R86.1 U25.2(SO/SIO1)
NetR87_1: R87.1 U25.3(~{WP}/SIO2)
NetR88_1: R88.1 U25.7(~{HOLD}/SIO3)
NetR89_2: R89.2 R94.1 U26.1(~{CS})
NetR90_1: R90.1 U26.3(~{WP}) U26.7(~{HOLD})
NetR91_1: R91.1 U26.2(SO)
NetR92_1: R92.1 U26.5(SI)
NetR93_1: R93.1 U26.6(SCK)

Not connected (* = marked no-connect by the designer): U19 E9(PF_5/U3_UCLK/SSP1_SSEL/TRACEDATA[0]/GPIO7[19]/SGPIO4/ADC1_4)* F13(P3_0/I2S0_RX_SCK/I2S0_RX_MCLK/I2S0_TX_SCK/I2S0_TX_MCLK/SSP0_SCK)* N6(P9_1/GPIO4[13]/MCOA2/I2S0_TX_WS/ENET_RX_ER/SGPIO1/SSP0_MISO)* N8(P9_2/GPIO4[14]/MCOB2/I2S0_TX_SDA/ENET_RXD3/SGPIO2/SSP0_MOSI)* R5(P1_5/GPIO1[8]/CTOUT_10/~{EMC_CS0}/USB0_PWR_FAULT/SSP1_SSEL/SGPIO15/SD_POW)* T1(P9_0/GPIO4[12]/~{MCABORT}/ENET_CRS/SGPIO0/SSP0_SSEL)*; U24 A7(RFU)* B3(DAT4)* B4(DAT5)* B5(DAT6)* B6(DAT7)* E5(RFU)* E8(VSF)* E9(VSF)* E10(VSF)* F10(VSF)* G10(VSF)* H5(RCLK/DS)* K6(RFU)* K7(RFU)* K10(VSF)* P10(VSF)*

### Notes on the sheet
- PROGRAM MEMORY
- PERMANENT LOG
- PCB REV
- Sheet
- of
- CCA REV
- (in symbol LPC43S57JET256E, part J) SD/MMC, SPIFI, SSP0, SSP1
- (in symbol SDINBDG4-8G-I1) 8GB; eMMC v5.x

### Library data of the parts
C52 C56 = CGA3E1X7R0J225M080AC: CAP CER 2.2UF 6.3V X7R 0603; Manufacturer: TDK Corporation; Tolerance: ±20%; Substitution Notes: 2.2µF , 6.3V , ±20% , X7R , -55°C ~ 125°C , AEC-Q200 , 0603; Value: 2.2µF; Temperature Coefficient: X7R; Manufacturer Part Number: CGA3E1X7R0J225M080AC; ComponentLink1Description: Datasheet (Internal); ComponentLink1URL: datasheets\TDK\mlcc_automotive_general_en.pdf; ComponentLink2Description: Datasheet (External); ComponentLink2URL: https://product.tdk.com/info/en/catalog/datasheets/mlcc_automotive_general_en.pdf; Supplier 1: Digikey; Supplier Part Number 1: 445-12572-1-ND; Category: Capacitors; Operating Temperature: -55°C ~ 125°C; Ratings: AEC-Q200; Package: 0603; Thickness (Max): 0.90MM; Features: -
C53-C55 = CGA2B3X7R1E104K050BB: as C34 on sheet Microprocessor Power; Value: 0.1µF; Temperature Coefficient: X7R; Manufacturer Part Number: CGA2B3X7R1E104K050BB; ComponentLink1Description: Datasheet (Internal); ComponentLink1URL: datasheets\TDK\mlcc_automotive_general_en.pdf; ComponentLink2Description: Datasheet (External); ComponentLink2URL: https://product.tdk.com/info/en/catalog/datasheets/mlcc_automotive_general_en.pdf; Supplier 1: Digikey; Supplier Part Number 1: 445-6902-1-ND; Category: Capacitors; Voltage - Rated: 25V; Operating Temperature: -55°C ~ 125°C; Ratings: AEC-Q200; Package: 0402; Thickness (Max): 0.55MM; Features: -
R75-R81 R89 R90 = ERJ-3EKF1002V: as R42 on sheet Microprocessor Power; Value: 10k; Supplier 1: Digi-Key; Supplier Part Number 1: P10.0KHCT-ND; Manufacturer Part Number: ERJ-3EKF1002V; Category: Resistors; Sort Value: 10000; Composition: Thick Film; Features: -; Tolerance: ±1%; Package: 0603 (1608 Metric); Size / Dimension: 0.063" L x 0.031" W (1.60mm x 0.80mm); Height: 0.55MM; Packaging: Cut Tape (CT); ComponentLink1URL: datasheets\Panasonic Electronic Components\AOA0000CE2.pdf; ComponentLink1Description: Internal Datasheet; ComponentLink2Description: External Datasheet; ComponentLink2URL: http://industrial.panasonic.com/www-data/pdf/AOA0000/AOA0000CE2.pdf; Resistance (Ohms): 10k; Supplier Package: 0603; Number of Terminations: 2; Sort Value Package: 603_10000; Ratings: AEC-Q200
R82 = ERJ-3EKF1001V: as R63 on sheet Microprocessor1; Value: 1k; Manufacturer Part Number: ERJ-3EKF1001V; ComponentLink1Description: Internal Datasheet; ComponentLink1URL: datasheets\Panasonic Electronic Components\AOA0000CE2.pdf; ComponentLink2Description: External Datasheet; ComponentLink2URL: http://industrial.panasonic.com/www-data/pdf/AOA0000/AOA0000CE2.pdf; Supplier 1: Digi-Key; Supplier Part Number 1: P1.00KHCT-ND; Category: Resistors; Resistance (Ohms): 1k; Composition: Thick Film; Features: -; Tolerance: ±1%; Package: 0603 (1608 Metric); Supplier Package: 0603; Size / Dimension: 0.063" L x 0.031" W (1.60mm x 0.80mm); Height: 0.55MM; Number of Terminations: 2; Packaging: Cut Tape (CT); Sort Value: 1000; Sort Value Package: 603_1000; Ratings: AEC-Q200
R83-R88 R91-R94 = ERJ-3EKF33R0V: RES 33 OHM 1/10W 1% 0603 SMD; Manufacturer: Panasonic Electronic Components; Power (Watts): 0.1W- 1/10W; Temperature Coefficient: ±100ppm/°C; Package Power: 0603  (0.1W); Limiting Element Voltage: 75; Maximum Overload Voltage: 150; Maximum Working Voltage: 1.8V; Substitution Notes: 33 , ±1% , 0603 , AEC-Q200; Value: 33; Supplier 1: Digi-Key; Supplier Part Number 1: P33.0HCT-ND; Manufacturer Part Number: ERJ-3EKF33R0V; Category: Resistors; Sort Value: 33; Composition: Thick Film; Features: -; Tolerance: ±1%; Package: 0603 (1608 Metric); Size / Dimension: 0.063" L x 0.031" W (1.60mm x 0.80mm); Height: 0.55MM; Packaging: Cut Tape (CT); ComponentLink1URL: datasheets\Panasonic Electronic Components\AOA0000CE2.pdf; ComponentLink1Description: Internal Datasheet; ComponentLink2Description: External Datasheet; ComponentLink2URL: http://industrial.panasonic.com/www-data/pdf/AOA0000/AOA0000CE2.pdf; Resistance (Ohms): 33; Supplier Package: 0603; Number of Terminations: 2; Sort Value Package: 603_33; Ratings: AEC-Q200
TP18 = TP SMT 25MIL: Sort Value: *; Category: *; CategorySort: *
U19 = LPC43S57JET256E: as U19 on sheet Microprocessor1; Value: LPC43S57JET256E; Sort Value: *; Category: Integrated Circuits; Supplier 1: Digi-Key; Supplier Part Number 1: 568-11712-ND; Manufacturer Part Number: LPC43S57JET256E; RoHS: RoHS Compliant; Stock 1: 108; Pricing 1: 1=14.40, 25=13.31, 100=12.24, 250=11.16, 500=10.43, 1000=9.57 (USD); Package: LBGA-256; Packaging: Tray; Mounting Style: SMD/SMT; Program Memory Size: 1 MB; Data Bus Width: 32 bit; Maximum Operating Temperature: + 85 C; Minimum Operating Temperature: - 40 C; Standard Pack Qty: 90; Tradename: LPC; RoHS - Mouser: Y; Minimum Order Quantity: 1; Reeling: False; ComponentLink1URL: http://www.nxp.com/documents/data_sheet/LPC4357_53_37_33.pdf; ComponentLink1Description: http://www.nxp.com/documents/data_sheet/LPC4357_53_37_33.pdf
U24 = SDINBDG4-8G-I1: eMMC eMMC seq 300/40 IOPs 7800/8000; Manufacturer: SanDisk; CategorySort: 600; Memory Size: 8 GB; Product Status: New Product; Category: Integrated Circuits; Value: SDINBDG4-8G-I1; Supplier 1: Mouser; Supplier Part Number 1: 467-SDINBDG4-8G-I1; Manufacturer Part Number: SDINBDG4-8G-I1; RoHS: RoHS Compliant; Stock 1: 2925; Pricing 1: 1=9.57, 5=9.03, 10=8.76, 25=8.65, 50=8.61, 100=8.33, 250=8.12, 500=7.95, 1000=7.86 (USD); Series: iNAND 7250; Brand: SanDisk; Moisture Sensitive: Yes; Product Type: eMMC; Standard Pack Qty: 152; Subcategory: Memory & Data Storage; Tradename: iNAND; RoHS - Mouser: Y; Minimum Order Quantity: 1; Reeling: False; ComponentLink1URL: http://www.mouser.com/datasheet/2/669/sandisk_09132017_SanDisk_COM-AUTO-INDUST_DISTI_LIN-1145140.pdf; ComponentLink1Description: http://www.mouser.com/datasheet/2/669/sandisk_09132017_SanDisk_COM-AUTO-INDUST_DISTI_LIN-1145140.pdf
U25 = W25Q128JVSIMTR: IC FLASH 128M SPI 133MHZ 8SOIC; Manufacturer: Winbond; CategorySort: 600; Category: Integrated Circuits; Value: W25Q128JVSIMTR; Supplier 1: Digi-Key; Supplier Part Number 1: W25Q128JVSIMCT-ND; Manufacturer Part Number: W25Q128JVSIMTR; Stock 1: 44076; Pricing 1: 1=1.62000, 10=1.47500, 25=1.43560, 50=1.42800, 100=1.27650, 250=1.27272, 500=1.25378, 1000=1.20000 (USD); RoHS: No; ComponentLink1URL: http://www.winbond.com/resource-files/w25q128jv_dtr%20revc%2003272018%20plus.pdf?src-supplier=Digi-Key; ComponentLink1Description: http://www.winbond.com/resource-files/w25q128jv_dtr%20revc%2003272018%20plus.pdf?src-supplier=Digi-Key
U26 = FM25CL64B-G: IC FRAM 64K SPI 20MHZ 8SOIC; Manufacturer: Cypress; CategorySort: 600; Density: 64Kb; Operating Supply Voltage: 3.3V; Packaging 1: Rail/Tube; Memory Type: RAM; Data Bus Width: 8b; Max Supply Voltage: 3.65V; Min Supply Voltage: 2.7V; Nominal Supply Current: 3mA; Access Time: 20ns; Number of Words: 8000; Category: Integrated Circuits; Value: FM25CL64B-G; Supplier 1: Digi-Key; Supplier Part Number 1: 428-3206-ND; Manufacturer Part Number: FM25CL64B-G; Stock 1: 2473; Pricing 1: 1=3.67000, 10=3.32800, 25=3.25640, 50=3.23820, 100=2.90400, 485=2.89322, 970=2.69456, 1455=2.64940 (USD); RoHS: Yes; Mount: Surface Mount; Case/Package: SOIC; Number of Pins: 8; Weight: 0.019048oz; Contact Plating: Tin; Min Operating Temperature: -40°C; Max Operating Temperature: 85°C; Interface: SPI; Frequency: 20MHz; Package Quantity: 100; Memory Size: 64Kb; Word Size: 8b; Length: 4.98mm; Height: 1.478mm; Width: 3.987mm; Radiation Hardening: No; Lead Free: Lead Free; REACH SVHC: No SVHC; ComponentLink1URL: https://datasheet.ciiva.com/26942/getdatasheetpartid-672928-26942246.pdf?src-supplier=Verical; ComponentLink1Description: https://datasheet.ciiva.com/26942/getdatasheetpartid-672928-26942246.pdf?src-supplier=Verical; ComponentLink2URL: https://datasheet.ciiva.com/12072/fm25cl64b-001-84477-0e-v-477223-12072828.pdf?src-supplier=Mouser; ComponentLink2Description: https://datasheet.ciiva.com/12072/fm25cl64b-001-84477-0e-v-477223-12072828.pdf?src-supplier=Mouser; ComponentLink3URL: https://datasheet.ciiva.com/6614/docid-47959-6614270.pdf?src-supplier=Digi-Key; ComponentLink3Description: https://datasheet.ciiva.com/6614/docid-47959-6614270.pdf?src-supplier=Digi-Key